# Altium schematic sheet Connectors.SchDoc
size A4; SheetNumber: 2; SheetTotal: 6
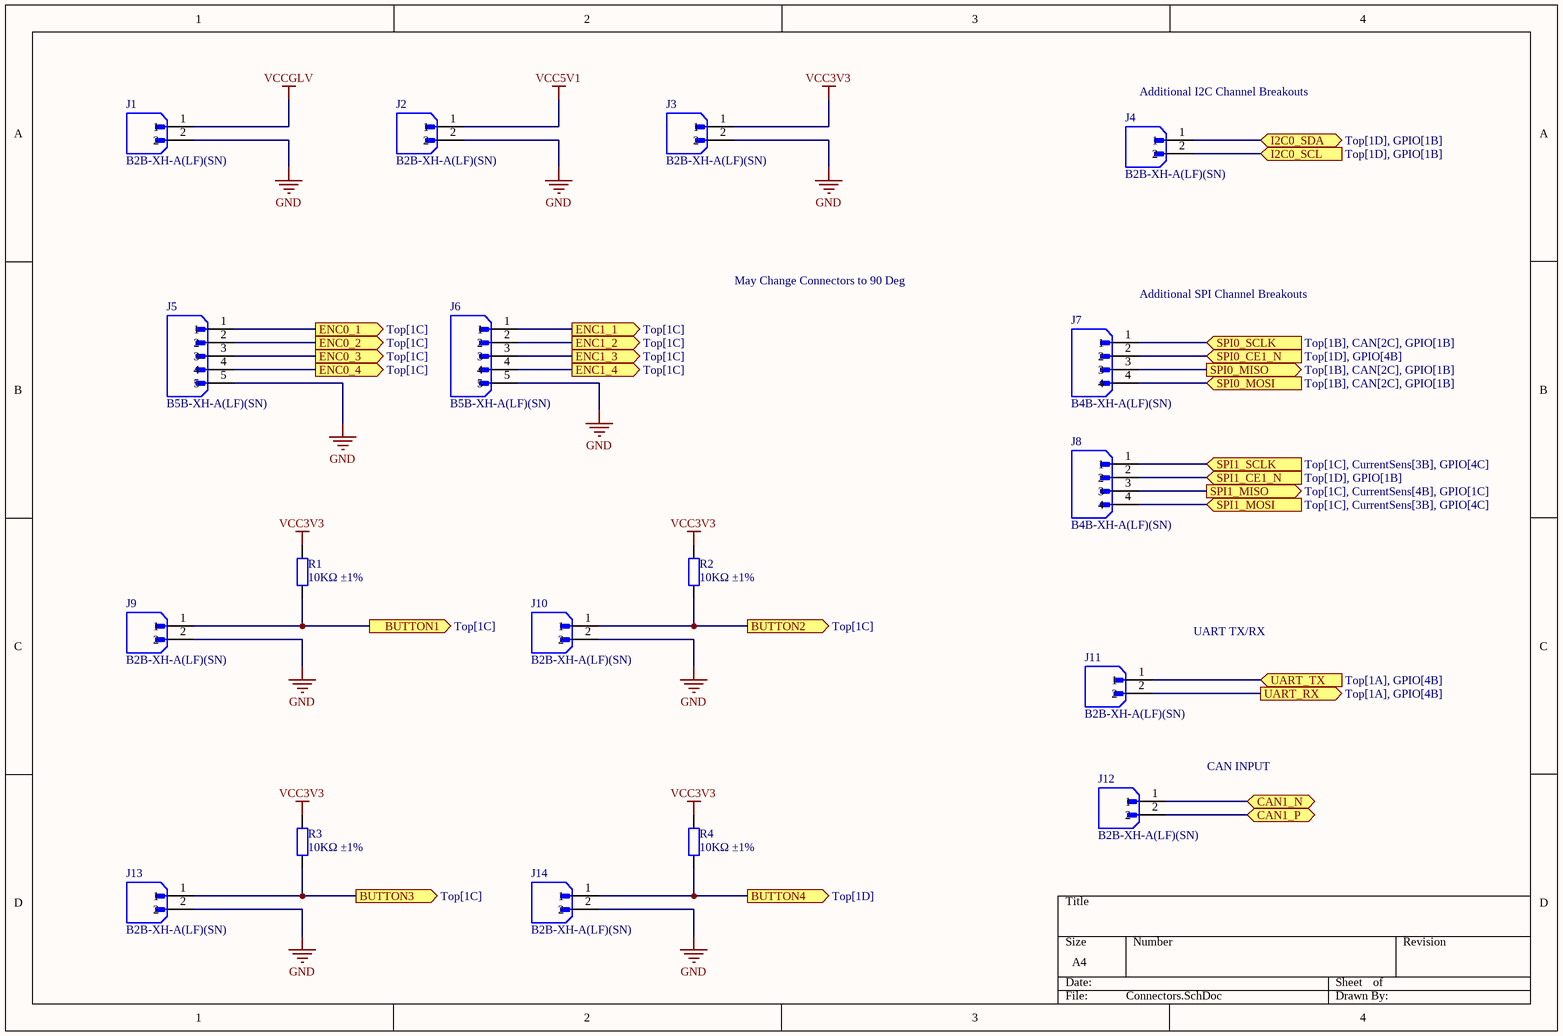
[diagram p0: Connectors.SchDoc]

## Parts
J1  B2B-XH-A(LF)(SN)  [JST_B2B-XH-A(LF)(SN)]
J2  B2B-XH-A(LF)(SN)  [JST_B2B-XH-A(LF)(SN)]
J3  B2B-XH-A(LF)(SN)  [JST_B2B-XH-A(LF)(SN)]
J4  B2B-XH-A(LF)(SN)  [JST_B2B-XH-A(LF)(SN)]
J5  B5B-XH-A(LF)(SN)  [JST_B5B-XH-A(LF)(SN)]
J6  B5B-XH-A(LF)(SN)  [JST_B5B-XH-A(LF)(SN)]
J7  B4B-XH-A(LF)(SN)  [JST_B4B-XH-A(LF)(SN)]
J8  B4B-XH-A(LF)(SN)  [JST_B4B-XH-A(LF)(SN)]
J9  B2B-XH-A(LF)(SN)  [JST_B2B-XH-A(LF)(SN)]
J10  B2B-XH-A(LF)(SN)  [JST_B2B-XH-A(LF)(SN)]
J11  B2B-XH-A(LF)(SN)  [JST_B2B-XH-A(LF)(SN)]
J12  B2B-XH-A(LF)(SN)  [JST_B2B-XH-A(LF)(SN)]
J13  B2B-XH-A(LF)(SN)  [JST_B2B-XH-A(LF)(SN)]
J14  B2B-XH-A(LF)(SN)  [JST_B2B-XH-A(LF)(SN)]
R1  10KΩ ±1%  [0402_R]
R2  10KΩ ±1%  [0402_R]
R3  10KΩ ±1%  [0402_R]
R4  10KΩ ±1%  [0402_R]

## Ports
BUTTON1 (out, see Top[1C]), BUTTON2 (out, see Top[1C]), BUTTON3 (out, see Top[1C]), BUTTON4 (out, see Top[1D]), CAN1_N (bidir, see Top[1A], CAN[2A]), CAN1_P (bidir, see Top[1A], CAN[2A]), ENC0_1 (out, see Top[1C]), ENC0_2 (out, see Top[1C]), ENC0_3 (out, see Top[1C]), ENC0_4 (out, see Top[1C]), ENC1_1 (out, see Top[1C]), ENC1_2 (out, see Top[1C]), ENC1_3 (out, see Top[1C]), ENC1_4 (out, see Top[1C]), I2C0_SCL (in, see Top[1D], GPIO[1B]), I2C0_SDA (bidir, see Top[1D], GPIO[1B]), SPI0_CE1_N (in, see Top[1D], GPIO[4B]), SPI0_MISO (out, see Top[1B], CAN[2C], GPIO[1B]), SPI0_MOSI (in, see Top[1B], CAN[2C], GPIO[1B]), SPI0_SCLK (in, see Top[1B], CAN[2C], GPIO[1B]), SPI1_CE1_N (in, see Top[1D], GPIO[1B]), SPI1_MISO (out, see Top[1C], CurrentSens[4B], GPIO[1C]), SPI1_MOSI (in, see Top[1C], CurrentSens[3B], GPIO[4C]), SPI1_SCLK (in, see Top[1C], CurrentSens[3B], GPIO[4C]), UART_RX (out, see Top[1A], GPIO[4B]), UART_TX (in, see Top[1A], GPIO[4B])

## Nets
GND: J1.2 J2.2 J3.2 J5.5 J6.5 J9.2 J10.2 J13.2 J14.2
VCC3V3: J3.1 R1.2 R2.2 R3.2 R4.2
VCC5V1: J2.1
VCCGLV: J1.1
BUTTON1: J9.1 R1.1 ; port BUTTON1
BUTTON2: J10.1 R2.1 ; port BUTTON2
BUTTON3: J13.1 R3.1 ; port BUTTON3
BUTTON4: J14.1 R4.1 ; port BUTTON4
CAN1_N: J12.1 ; port CAN1_N
CAN1_P: J12.2 ; port CAN1_P
ENC0_1: J5.1 ; port ENC0_1
ENC0_2: J5.2 ; port ENC0_2
ENC0_3: J5.3 ; port ENC0_3
ENC0_4: J5.4 ; port ENC0_4
ENC1_1: J6.1 ; port ENC1_1
ENC1_2: J6.2 ; port ENC1_2
ENC1_3: J6.3 ; port ENC1_3
ENC1_4: J6.4 ; port ENC1_4
I2C0_SCL: J4.2 ; port I2C0_SCL
I2C0_SDA: J4.1 ; port I2C0_SDA
SPI0_CE1_N: J7.2 ; port SPI0_CE1_N
SPI0_MISO: J7.3 ; port SPI0_MISO
SPI0_MOSI: J7.4 ; port SPI0_MOSI
SPI0_SCLK: J7.1 ; port SPI0_SCLK
SPI1_CE1_N: J8.2 ; port SPI1_CE1_N
SPI1_MISO: J8.3 ; port SPI1_MISO
SPI1_MOSI: J8.4 ; port SPI1_MOSI
SPI1_SCLK: J8.1 ; port SPI1_SCLK
UART_RX: J11.2 ; port UART_RX
UART_TX: J11.1 ; port UART_TX

## Notes on the sheet
- (near J4) Additional I2C Channel Breakouts
- May Change Connectors to 90 Deg
- (near J7) Additional SPI Channel Breakouts
- UART TX/RX
- CAN INPUT

## Library data of the parts
J1-J4 J9-J14 = B2B-XH-A(LF)(SN): Connector Header Through Hole 2 position 0.098 (2.50mm); MF: JST Sales; SnapEDA_Link: https://www.snapeda.com/parts/B2B-XH-A(LF)(SN)/JST+Sales+America+Inc./view-part/?ref=snap; Check_prices: https://www.snapeda.com/parts/B2B-XH-A(LF)(SN)/JST+Sales+America+Inc./view-part/?ref=eda; Value: *; MP: B2B-XH-A(LF)(SN); Package: None
J5 J6 = B5B-XH-A(LF)(SN): Connector Header Through Hole 5 position 0.098 (2.50mm); MF: JST Sales America Inc.; MP: B5B-XH-A(LF)(SN); Value: *; Availability: In Stock; Package: None; Purchase-URL: https://pricing.snapeda.com/search/part/B5B-XH-A(LF)(SN)/?ref=eda; Price: None; SnapEDA_Link: https://www.snapeda.com/parts/B5B-XH-A(LF)(SN)/JST+Sales+America+Inc./view-part/?ref=snap; Check_prices: https://www.snapeda.com/parts/B5B-XH-A(LF)(SN)/JST+Sales+America+Inc./view-part/?ref=eda
J7 J8 = B4B-XH-A(LF)(SN): Connector Header Through Hole 4 position 0.098 (2.50mm); MF: JST Sales; SnapEDA_Link: https://www.snapeda.com/parts/B4B-XH-A(LF)(SN)/JST+Sales+America+Inc./view-part/?ref=snap; Package: None; MP: B4B-XH-A(LF)(SN); Check_prices: https://www.snapeda.com/parts/B4B-XH-A(LF)(SN)/JST+Sales+America+Inc./view-part/?ref=eda; Purchase-URL: https://pricing.snapeda.com/search/part/B4B-XH-A(LF)(SN)/?ref=eda; Price: None; Value: *; Availability: In Stock
R1-R4 = 0402 10K (1002) 1%: Chip resistor; Manufacturer: Uniroyal Elec; PartNumber: 0402WGF1002TCE; Power: 1/16W; ComponentLink1Description: Supplier link; ComponentLink1URL: http://www.szlcsc.com/product/details_26487.html; Package: 0402; Supplier: LC; SuppliersPartNumber: C25744; Resistance: 10KΩ; Tolerance: 1%